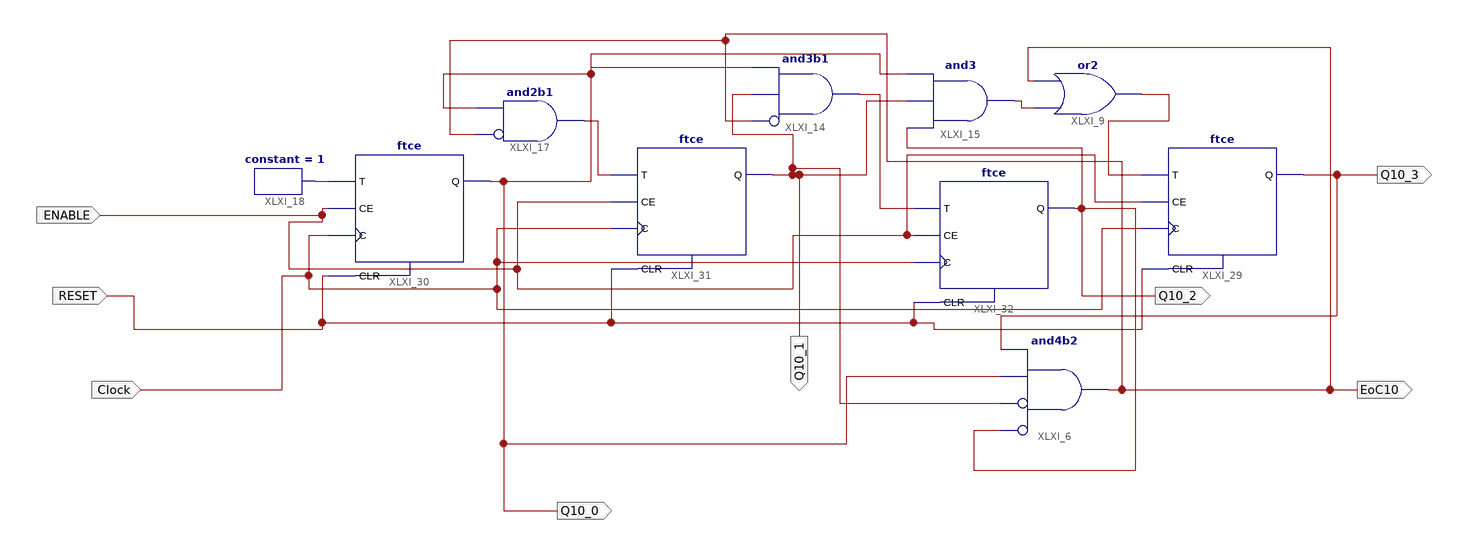
[diagram p0: schematic sheet 1]
// Xilinx ISE schematic Modulo10.sch (spartan6) as structural Verilog: 10 symbols, 8 ports
module Modulo10 (
  input  Clock,
  input  ENABLE,
  input  RESET,
  output EoC10,
  output Q10_3,
  output Q10_2,
  output Q10_1,
  output Q10_0
);

  wire XLXN_5, XLXN_10, XLXN_13, XLXN_24, XLXN_31;

  and XLXI_6 (EoC10, ~Q10_2, ~Q10_1, Q10_0, Q10_3);  // and4b2
  or XLXI_9 (XLXN_13, XLXN_24, EoC10);
  and XLXI_14 (XLXN_10, ~EoC10, Q10_1, Q10_0);  // and3b1
  and XLXI_15 (XLXN_24, Q10_2, Q10_1, Q10_0);
  and XLXI_17 (XLXN_5, ~EoC10, Q10_0);  // and2b1
  constant #(.CValue("1")) XLXI_18 (.O(XLXN_31));
  ftce XLXI_29 (.C(Clock), .CE(ENABLE), .CLR(RESET), .T(XLXN_13), .Q(Q10_3));
  ftce XLXI_30 (.C(Clock), .CE(ENABLE), .CLR(RESET), .T(XLXN_31), .Q(Q10_0));
  ftce XLXI_31 (.C(Clock), .CE(ENABLE), .CLR(RESET), .T(XLXN_5), .Q(Q10_1));
  ftce XLXI_32 (.C(Clock), .CE(ENABLE), .CLR(RESET), .T(XLXN_10), .Q(Q10_2));
endmodule
